# Altium schematic sheet MIDIPianoTop.SchDoc
size A3; DrawnBy: AG Funds Music Research Dept.; SheetNumber: 1
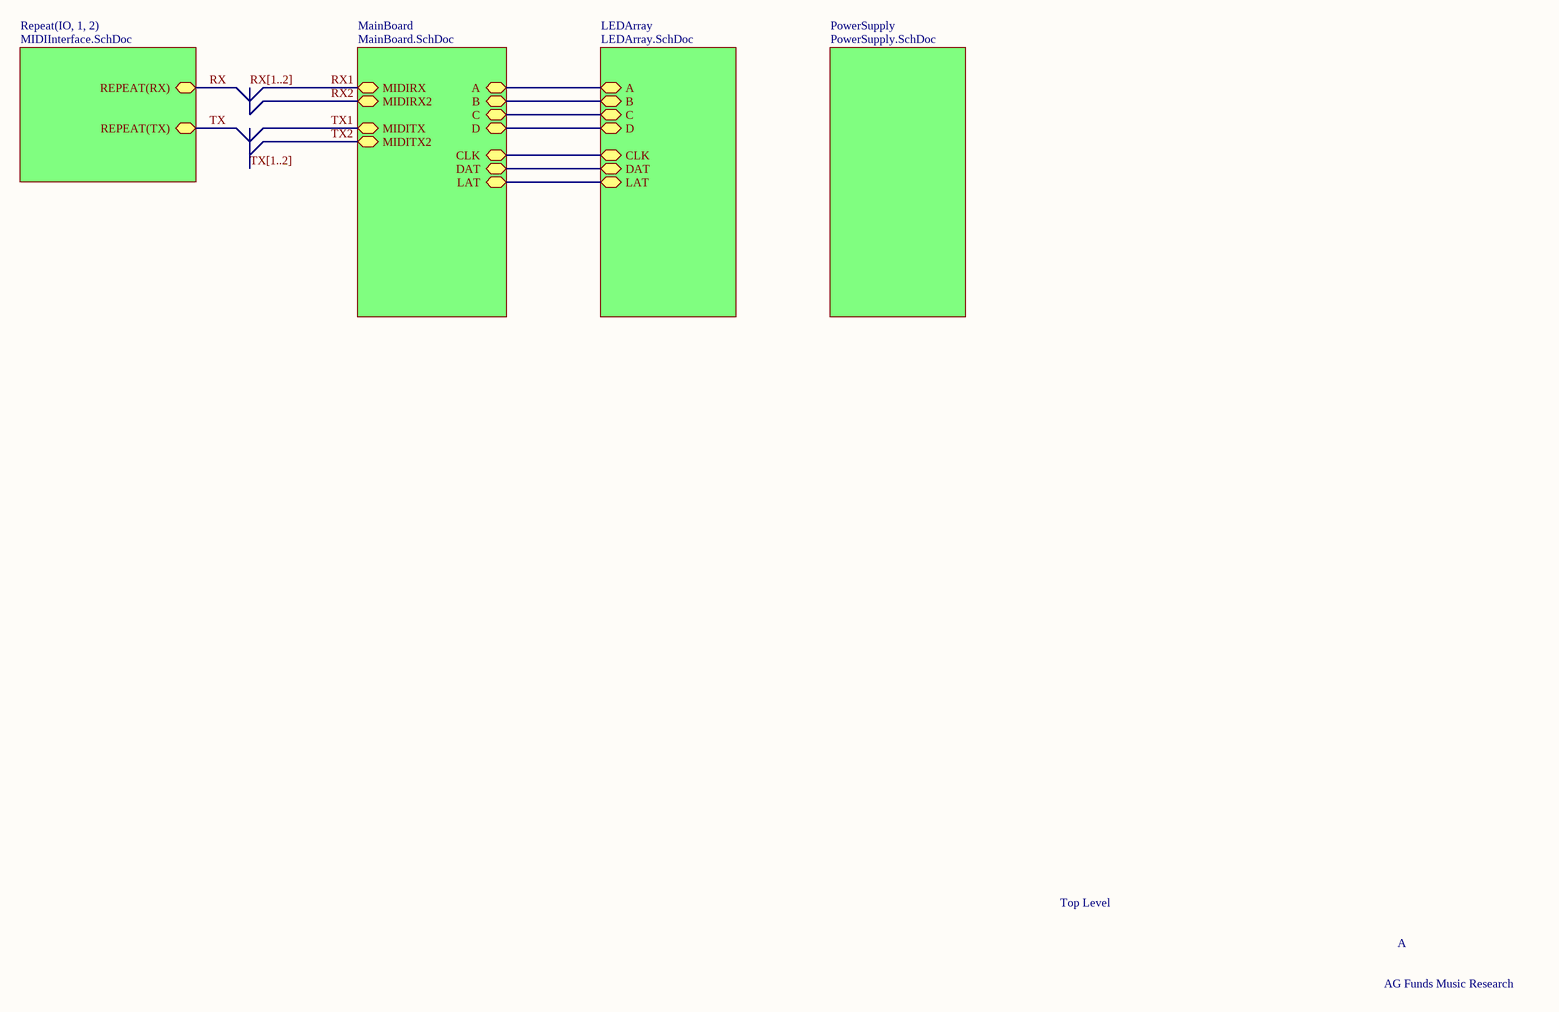
[diagram p0: MIDIPianoTop.SchDoc]

## Sub-sheets
LEDArray = LEDArray.SchDoc: A, B, C, D, CLK, LAT, DAT
MainBoard = MainBoard.SchDoc: A, B, C, D, CLK, LAT, DAT, MIDIRX, MIDITX, MIDIRX2, MIDITX2
PowerSupply = PowerSupply.SchDoc: no entries
Repeat(IO, 1, 2) = MIDIInterface.SchDoc: REPEAT(RX), REPEAT(TX)

## Nets
RX: sheet Repeat(IO, 1, 2)/REPEAT(RX)
RX1: sheet MainBoard/MIDIRX
RX2: sheet MainBoard/MIDIRX2
TX: sheet Repeat(IO, 1, 2)/REPEAT(TX)
TX1: sheet MainBoard/MIDITX
TX2: sheet MainBoard/MIDITX2
(unnamed): sheet LEDArray/A, sheet MainBoard/A
(unnamed): sheet LEDArray/B, sheet MainBoard/B
(unnamed): sheet LEDArray/C, sheet MainBoard/C
(unnamed): sheet LEDArray/D, sheet MainBoard/D
(unnamed): sheet LEDArray/CLK, sheet MainBoard/CLK
(unnamed): sheet LEDArray/LAT, sheet MainBoard/LAT
(unnamed): sheet LEDArray/DAT, sheet MainBoard/DAT

## Buses and harness runs
bus RX[1..2]
bus TX[1..2]

## Notes on the sheet
- Top Level
- A
- AG Funds Music Research